# EAGLE schematic LoadCkt (EAGLE 9.2.0)
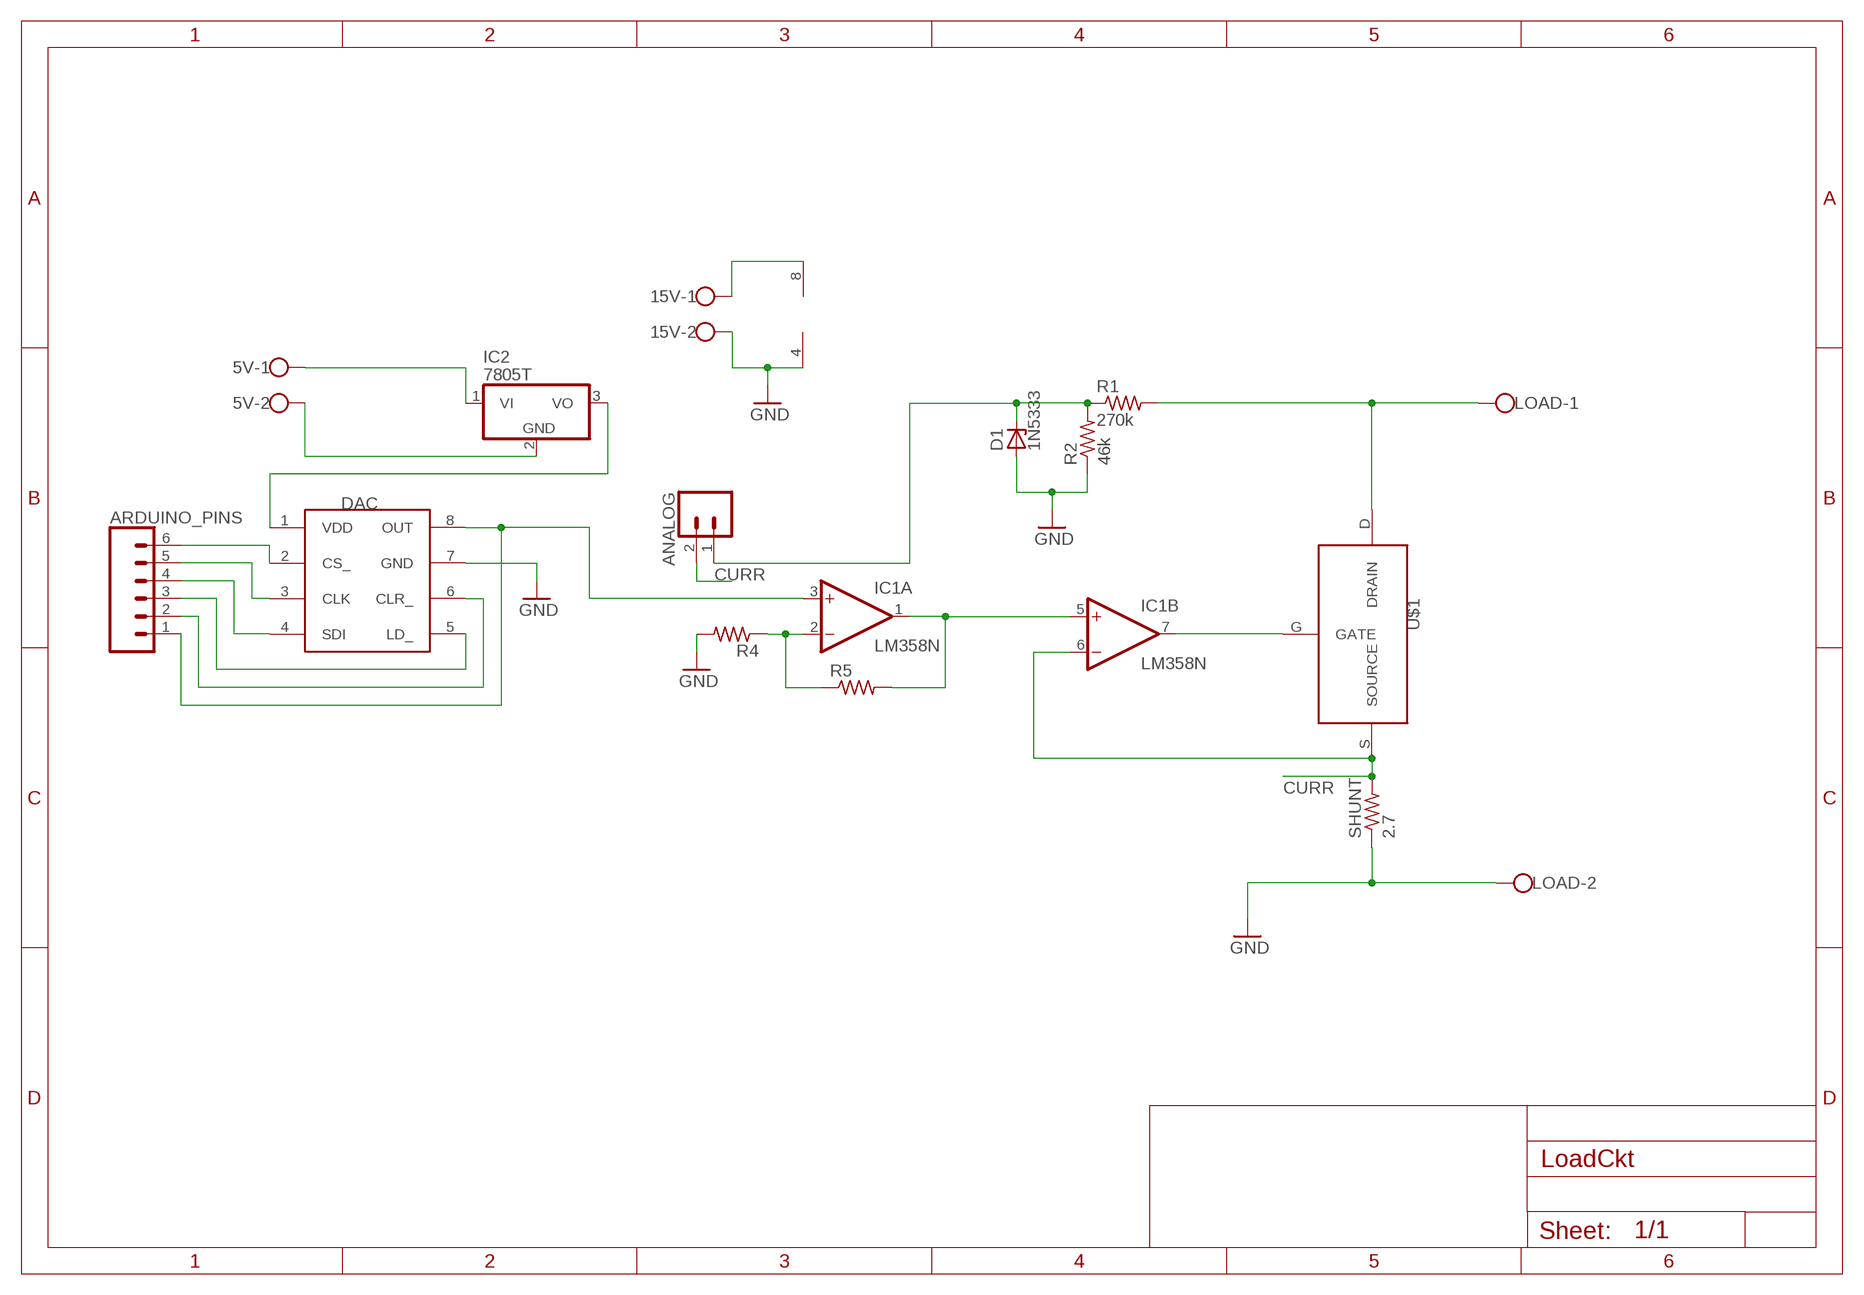
[diagram p0: schematic, sheet 1]

## Parts
5V  W237-102  [W237-102]
15V  W237-102  [W237-102]
ANALOG  CONN_02  [1X02]
ARDUINO_PINS  CONN_06SILK_FEMALE_PTH  [1X06]
D1  1N5333  [C1702-15]
DAC  DAC7611DIP  [DP-04]
IC1  LM358N  [DIL08]
IC2  7805T  [TO220H]
LOAD  W237-102  [W237-102]
R1  270k  R-US_0204/7  [0204/7]
R2  46k  R-US_0204/7  [0204/7]
R4  R-US_0204/7  [0204/7]
R5  R-US_0204/7  [0204/7]
SHUNT  2.7  R-US_0204/7  [0204/7]
U$1  IRFP4468  [TO-247AD-H]

## Nets
CURR: ANALOG.2 IC1.6(B:-IN) SHUNT.2 U$1.S(SOURCE)
GND: 15V.2 D1.A DAC.7(GND) IC1.4(P:V-) LOAD.2 R2.1 R4.2 SHUNT.1
N$1: ANALOG.1 D1.C R1.1 R2.2
N$2: 5V.1 IC2.1(VI)
N$3: 5V.2 IC2.2(GND)
N$4: DAC.1(VDD) IC2.3(VO)
N$5: ARDUINO_PINS.6 DAC.2(CS_)
N$6: ARDUINO_PINS.5 DAC.3(CLK)
N$7: ARDUINO_PINS.4 DAC.4(SDI)
N$8: ARDUINO_PINS.3 DAC.5(LD_)
N$9: ARDUINO_PINS.2 DAC.6(CLR_)
N$10: ARDUINO_PINS.1 DAC.8(OUT) IC1.3(A:+IN)
N$11: LOAD.1 R1.2 U$1.D(DRAIN)
N$12: IC1.7(B:OUT) U$1.G(GATE)
N$13: IC1.2(A:-IN) R4.1 R5.1
N$14: IC1.1(A:OUT) IC1.5(B:+IN) R5.2
N$16: 15V.1 IC1.8(P:V+)

## Library data of the parts
5V 15V LOAD = con-wago-500:W237-102: WAGO SCREW CLAMP; MPN: 237-102; OC_FARNELL: unknown; OC_NEWARK: 70K9898
ANALOG = SparkFun-Connectors:CONN_02: Multi connection point. Often used as Generic Header-pin footprint for 0.1 inch spaced/style header connections On any of the 0.1 inch spaced packages, you can populate with these: Break Away Headers - Straight <https://www.sparkfun.com/products/116> (PRT-00116) Break Away Male Headers - Right Angle <https://www.sparkfun.com/products/553> (PRT-00553) Female Headers <https://www.sparkfun.com/products/115> (PRT-00115) Break Away Headers - Machine Pin <https://www.sparkfun.com/products/117> (PRT-00117) Break Away Female Headers - Swiss Machine Pin <https://www.sparkfun.com/products/743> (PRT-00743) For SCREWTERMINALS and SPRING TERMINALS visit here: Screw Terimnals on SparkFun.com <https://www.sparkfun.com/search/results?term=Screw+Terminals> (5mm/3.5mm/2.54mm spacing) This device is also useful as a general connection point to wire up your design to another part of your project. Our various solder wires solder well into these plated through hole pads. Hook-Up Wire - Assortment (Stranded, 22 AWG) <https://www.sparkfun.com/products/11375> (PRT-11375) Hook-Up Wire - Assortment (Solid Core, 22 AWG) <https://www.sparkfun.com/products/11367> (PRT-11367) View the entire wire category on our website here <https://www.sparkfun.com/categories/141> Special notes: Molex polarized connector foot print use with: PRT-08233 with associated crimp pins and housings. 2.54_SCREWTERM for use with PRT-10571. 3.5mm Screw Terminal footprints for PRT-08084 5mm Screw Terminal footprints for use with PRT-08432
ARDUINO_PINS = SparkFun-Connectors:CONN_06: Multi connection point. Often used as Generic Header-pin footprint for 0.1 inch spaced/style header connections On any of the 0.1 inch spaced packages, you can populate with these: Break Away Headers - Straight <https://www.sparkfun.com/products/116> (PRT-00116) Break Away Male Headers - Right Angle <https://www.sparkfun.com/products/553> (PRT-00553) Female Headers <https://www.sparkfun.com/products/115> (PRT-00115) Break Away Headers - Machine Pin <https://www.sparkfun.com/products/117> (PRT-00117) Break Away Female Headers - Swiss Machine Pin <https://www.sparkfun.com/products/743> (PRT-00743) Arduino Stackable Header - 6 Pin <https://www.sparkfun.com/products/9280> (PRT-09280) For SCREWTERMINALS and SPRING TERMINALS visit here: Screw Terimnals on SparkFun.com <https://www.sparkfun.com/search/results?term=Screw+Terminals> (5mm/3.5mm/2.54mm spacing) This device is also useful as a general connection point to wire up your design to another part of your project. Our various solder wires solder well into these plated through hole pads. Hook-Up Wire - Assortment (Stranded, 22 AWG) <https://www.sparkfun.com/products/11375> (PRT-11375) Hook-Up Wire - Assortment (Solid Core, 22 AWG) <https://www.sparkfun.com/products/11367> (PRT-11367) View the entire wire category on our website here <https://www.sparkfun.com/categories/141>; PROD_ID: CONN-08437
D1 = diode:1N5333: Z DIODE 3.3 V, 5W, 5 percent (Motorola)
DAC = DC Load:DAC7611
IC1 = linear:LM358: OP AMP also LM158; LM258; LM2904 Source: http://cache.national.com/ds/LM/LM158.pdf
IC2 = linear:78*: Positive VOLTAGE REGULATOR Source: http://cache.national.com/ds/LM/LM78L05.pdf http://www.fairchildsemi.com/ds/LM/LM7805.pdf
R1 R2 R4 R5 SHUNT = rcl:R-US_: RESISTOR, American symbol; SPICEPREFIX: R
U$1 = DC Load:IRFP4468